# Altium project Audio_Research.PrjPcb (part 5 of 6)

## Sheet Audio_Input_Digitial_Mic.SchDoc: Audio Research: MEMS Microphones
size A4; DrawnBy: Connor Dack; Engineer: Connor Dack; DocumentNumber: 16; Revision: 1.0; SheetNumber: 16; SheetTotal: 20
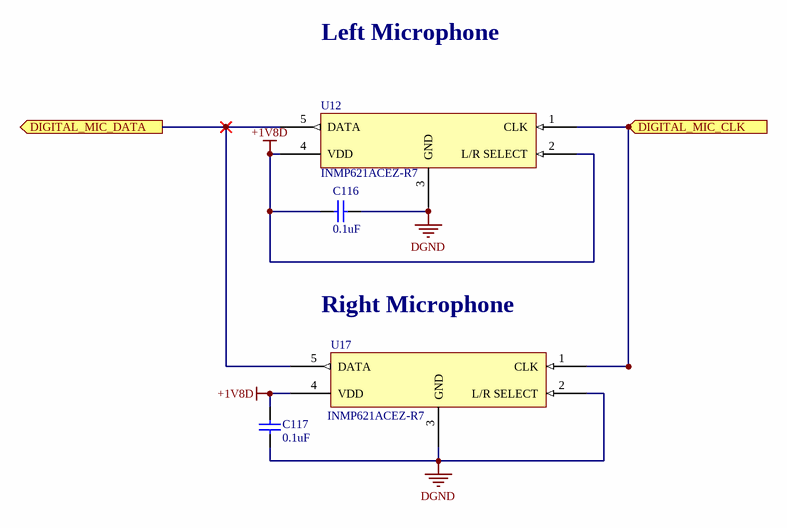
[diagram p14: Audio_Input_Digitial_Mic.SchDoc]

### Parts
C116  Capacitance: 0.1uF  [3-0603_L]  (hidden comment: CL10F104ZO8NNNC)
C117  Capacitance: 0.1uF  [3-0603_L]  (hidden comment: CL10F104ZO8NNNC)
U12  Manufacturer Part Number: INMP621ACEZ-R7  [INMP621]  (hidden comment: INMP621)
U17  Manufacturer Part Number: INMP621ACEZ-R7  [INMP621]  (hidden comment: INMP621)

### Ports
DIGITAL_MIC_CLK (in), DIGITAL_MIC_DATA (out)

### Nets
+1V8D: C116.2 C117.1 U12.2(L/R_SELECT) U12.4(VDD) U17.4(VDD)
DGND: C116.1 C117.2 U12.3(GND) U17.2(L/R_SELECT) U17.3(GND)  [project net AGND]
DIGITAL_MIC_CLK: U12.1(CLK) U17.1(CLK) ; port DIGITAL_MIC_CLK
DIGITAL_MIC_DATA: U12.5(DATA) U17.5(DATA) ; port DIGITAL_MIC_DATA

### Notes on the sheet
- Left Microphone
- (near U17) Right Microphone
- Title:
- Sheet:
- of
- Size:
- A4
- Rev:
- Date:
- Engineer:
- Time:
- File:

### Library data of the parts
C116 C117 = CL10F104ZO8NNNC: as C69 on sheet Audio_Input_Mic_In; Supplier 1: Digi-Key; Stock 1: 40000; Pricing 1: 1=0.1, 10=0.038, 100=0.0169, 500=0.01208, 1000=0.00949 (USD); Mount: Surface Mount; Case/Package: 0603; Case Code (Metric): 1608; Case Code (Imperial): 0603; Min Operating Temperature: -30°C; Max Operating Temperature: 85°C; Package Quantity: 1; Packaging: Tape and Reel; Voltage Rating: 16V; Dielectric: Y5V; Length: 1.6mm; Height: 0.8mm; Width: 0.031inch; Thickness: 0.035inch; Depth: 0.8mm; Radiation Hardening: No; ComponentLink1URL: https://datasheet.ciiva.com/25805/cl10f104zo8nnnc-25805810.pdf; ComponentLink1Description: https://datasheet.ciiva.com/25805/cl10f104zo8nnnc-25805810.pdf; ComponentLink2URL: https://datasheet.ciiva.com/16199/cl10f104zo8nnnc-16199254.pdf; ComponentLink2Description: https://datasheet.ciiva.com/16199/cl10f104zo8nnnc-16199254.pdf; Supplier Part Number 1: 1276-1258-6-ND; Manufacturer Part Number: CL10F104ZO8NNNC
U12 U17 = INMP621: 45Hz ~ 20kHz Digital, PDM Microphone MEMS (Silicon) Omnidirectional (-46dB ±2dB @ 94dB SPL) Solder Pads; Manufacturer: InvenSense; S/N Ratio: 65dB; Voltage Range: 1.62 ~ 3.63V; Current - Supply: 1.6mA; Port Location: Bottom; Seal Rating: None; Shape: Rectangular; Supplier 1: Digi-Key; RoHS: RoHS Compliant; Category: Audio Products; Stock 1: 1211; Pricing 1: 1=2.88, 10=2.491, 25=2.2292, 50=1.9668, 100=1.9012, 250=1.83568, 500=1.77012 (USD); Packaging: Cut Tape (CT); Part Status: Active; Type: MEMS (Silicon); Output Type: Digital, PDM; Direction: Omnidirectional; Frequency Range: 45Hz ~ 20kHz; Sensitivity: -46dB ±2dB @ 94dB SPL; Impedance: -; Voltage - Rated: -; Termination: Solder Pads; Size / Dimension: 4.00mm L x 3.00mm W; Height (Max): 1.10mm; ComponentLink1URL: https://www.invensense.com/wp-content/uploads/2015/02/INMP621.pdf; ComponentLink1Description: https://www.invensense.com/wp-content/uploads/2015/02/INMP621.pdf; Supplier Part Number 1: 1428-1018-1-ND

## Sheet FMC_Block_Diagram.SchDoc: FMC Block Diagram
size A4; DrawnBy: Connor Dack; Engineer: Connor Dack; DocumentNumber: 5; Revision: 1.0; SheetNumber: 5; SheetTotal: 20
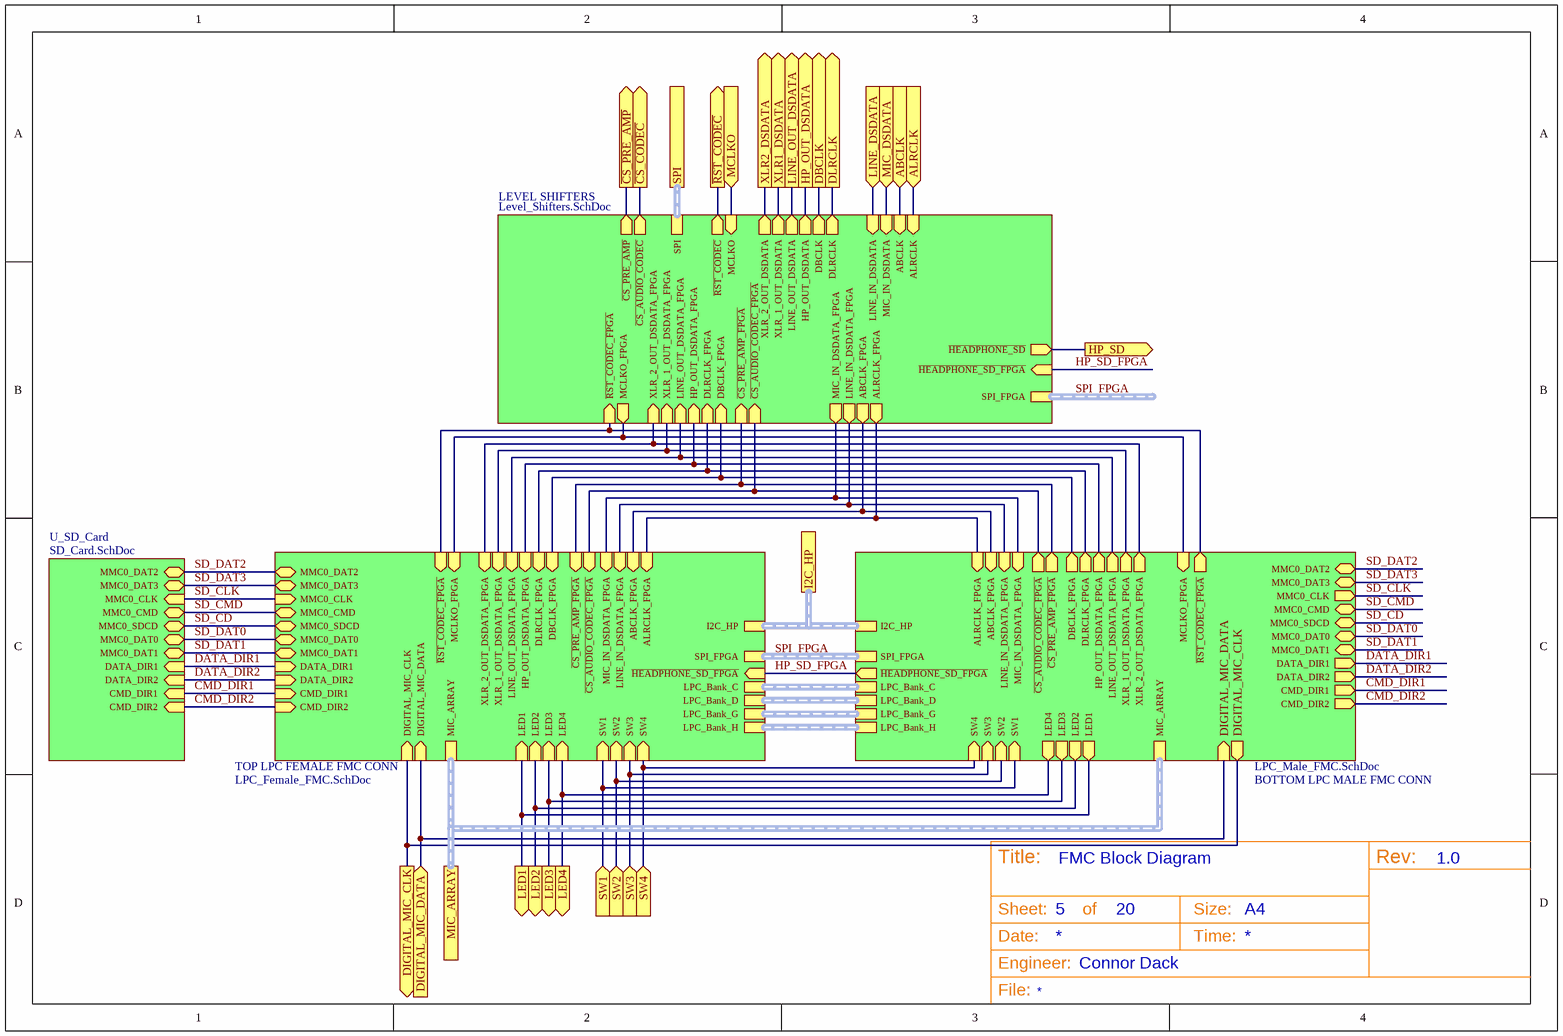
[diagram p15: FMC_Block_Diagram.SchDoc]

### Sub-sheets
BOTTOM LPC MALE FMC CONN = LPC_Male_FMC.SchDoc: SW1 (in), SW3 (in), SW2 (in), SW4 (in), LED1 (out), LED2 (out), LED3 (out), LED4 (out), MIC_ARRAY (harness Microphone Array), ABCLK_FPGA (in), ALRCLK_FPGA (in), DBCLK_FPGA (out), DLRCLK_FPGA (out), HP_OUT_DSDATA_FPGA (out), ~{HEADPHONE_SD_FPGA} (out), LINE_IN_DSDATA_FPGA (in), LINE_OUT_DSDATA_FPGA (out), MCLKO_FPGA (in), MIC_IN_DSDATA_FPGA (in), XLR_1_OUT_DSDATA_FPGA (out), XLR_2_OUT_DSDATA_FPGA (out), ~{RST_CODEC_FPGA} (out), SPI_FPGA (harness SPI_FPGA), ~{CS_AUDIO_CODEC_FPGA} (out), ~{CS_PRE_AMP_FPGA} (out), DIGITAL_MIC_CLK (out), DIGITAL_MIC_DATA (in), I2C_HP (harness I2C), MMC0_DAT2 (bidir), MMC0_DAT3 (bidir), MMC0_CLK (out), MMC0_CMD (bidir), MMC0_SDCD (bidir), MMC0_DAT0 (bidir), MMC0_DAT1 (bidir), LPC_Bank_H (harness LPC_Bank_H), LPC_Bank_G (harness LPC_Bank_G), LPC_Bank_D (harness LPC_Bank_D), LPC_Bank_C (harness LPC_Bank_C), DATA_DIR1 (out), CMD_DIR1 (out), DATA_DIR2 (out), CMD_DIR2 (out)
LEVEL SHIFTERS = Level_Shifters.SchDoc: XLR_2_OUT_DSDATA_FPGA (in), XLR_1_OUT_DSDATA_FPGA (in), LINE_OUT_DSDATA_FPGA (in), MIC_IN_DSDATA_FPGA (out), HP_OUT_DSDATA_FPGA (in), MCLKO_FPGA (out), ~{RST_CODEC_FPGA} (in), ~{HEADPHONE_SD_FPGA} (in), DLRCLK_FPGA (in), DBCLK_FPGA (in), ALRCLK_FPGA (out), ABCLK_FPGA (out), LINE_IN_DSDATA_FPGA (out), XLR_2_OUT_DSDATA (out), HP_OUT_DSDATA (out), MCLKO (in), XLR_1_OUT_DSDATA (out), LINE_OUT_DSDATA (out), MIC_IN_DSDATA (in), ~{RST_CODEC} (out), ~{HEADPHONE_SD} (out), DLRCLK (out), DBCLK (out), ALRCLK (in), ABCLK (in), LINE_IN_DSDATA (in), SPI (harness SPI), SPI_FPGA (harness SPI_FPGA), ~{CS_AUDIO_CODEC} (out), ~{CS_AUDIO_CODEC_FPGA} (in), ~{CS_PRE_AMP} (out), ~{CS_PRE_AMP_FPGA} (in)
TOP LPC FEMALE FMC CONN = LPC_Female_FMC.SchDoc: SW1 (in), SW3 (in), SW2 (in), SW4 (in), LED1 (in), LED2 (in), MIC_ARRAY (harness Microphone Array), LED3 (in), LED4 (in), DBCLK_FPGA (in), DLRCLK_FPGA (in), MIC_IN_DSDATA_FPGA (in), DIGITAL_MIC_DATA (in), ~{HEADPHONE_SD_FPGA} (in), DIGITAL_MIC_CLK (in), MCLKO_FPGA (in), ~{RST_CODEC_FPGA} (in), ALRCLK_FPGA (in), ABCLK_FPGA (in), LINE_IN_DSDATA_FPGA (in), SPI_FPGA (harness SPI_FPGA), HP_OUT_DSDATA_FPGA (in), LINE_OUT_DSDATA_FPGA (in), XLR_1_OUT_DSDATA_FPGA (in), XLR_2_OUT_DSDATA_FPGA (in), ~{CS_AUDIO_CODEC_FPGA} (in), ~{CS_PRE_AMP_FPGA} (in), I2C_HP (harness I2C), MMC0_DAT2 (bidir), MMC0_DAT3 (bidir), MMC0_CLK (in), MMC0_CMD (bidir), MMC0_SDCD (bidir), MMC0_DAT0 (bidir), MMC0_DAT1 (bidir), LPC_Bank_H (harness LPC_Bank_H), LPC_Bank_G (harness LPC_Bank_G), LPC_Bank_D (harness LPC_Bank_D), LPC_Bank_C (harness LPC_Bank_C), DATA_DIR1 (in), CMD_DIR1 (in), DATA_DIR2 (in), CMD_DIR2 (in)
U_SD_Card = SD_Card.SchDoc: MMC0_DAT2 (bidir), MMC0_DAT3 (bidir), MMC0_CLK (in), MMC0_CMD (bidir), MMC0_SDCD (bidir), MMC0_DAT0 (bidir), MMC0_DAT1 (bidir), DATA_DIR1 (in), CMD_DIR1 (in), DATA_DIR2 (in), CMD_DIR2 (in)

### Ports
ABCLK (in), ALRCLK (in), DBCLK (out), DIGITAL_MIC_CLK (out), DIGITAL_MIC_DATA (in), DLRCLK (out), HP_OUT_DSDATA (out), HP_SD (out), I2C_HP, LED1 (out), LED2 (out), LED3 (out), LED4 (out), LINE_DSDATA (in), LINE_OUT_DSDATA (out), MCLKO (in), MIC_ARRAY, MIC_DSDATA (in), SPI, SW1 (in), SW2 (in), SW3 (in), SW4 (in), XLR1_DSDATA (out), XLR2_DSDATA (out), ~{CS_CODEC} (out), ~{CS_PRE_AMP} (out), ~{RST_CODEC} (out)

### Nets
ABCLK: port ABCLK, sheet LEVEL SHIFTERS/ABCLK
ALRCLK: port ALRCLK, sheet LEVEL SHIFTERS/ALRCLK
~{CS_CODEC}: port ~{CS_CODEC}, sheet LEVEL SHIFTERS/~{CS_AUDIO_CODEC}
~{CS_PRE_AMP}: port ~{CS_PRE_AMP}, sheet LEVEL SHIFTERS/~{CS_PRE_AMP}
CMD_DIR1: sheet TOP LPC FEMALE FMC CONN/CMD_DIR1, sheet BOTTOM LPC MALE FMC CONN/CMD_DIR1, sheet U_SD_Card/CMD_DIR1
CMD_DIR2: sheet TOP LPC FEMALE FMC CONN/CMD_DIR2, sheet BOTTOM LPC MALE FMC CONN/CMD_DIR2, sheet U_SD_Card/CMD_DIR2
DATA_DIR1: sheet TOP LPC FEMALE FMC CONN/DATA_DIR1, sheet BOTTOM LPC MALE FMC CONN/DATA_DIR1, sheet U_SD_Card/DATA_DIR1
DATA_DIR2: sheet TOP LPC FEMALE FMC CONN/DATA_DIR2, sheet BOTTOM LPC MALE FMC CONN/DATA_DIR2, sheet U_SD_Card/DATA_DIR2
DBCLK: port DBCLK, sheet LEVEL SHIFTERS/DBCLK
DIGITAL_MIC_CLK: port DIGITAL_MIC_CLK, sheet TOP LPC FEMALE FMC CONN/DIGITAL_MIC_CLK, sheet BOTTOM LPC MALE FMC CONN/DIGITAL_MIC_CLK
DIGITAL_MIC_DATA: port DIGITAL_MIC_DATA, sheet TOP LPC FEMALE FMC CONN/DIGITAL_MIC_DATA, sheet BOTTOM LPC MALE FMC CONN/DIGITAL_MIC_DATA
DLRCLK: port DLRCLK, sheet LEVEL SHIFTERS/DLRCLK
HP_OUT_DSDATA: port HP_OUT_DSDATA, sheet LEVEL SHIFTERS/HP_OUT_DSDATA
HP_SD: port HP_SD, sheet LEVEL SHIFTERS/~{HEADPHONE_SD}
HP_SD_FPGA: sheet TOP LPC FEMALE FMC CONN/~{HEADPHONE_SD_FPGA}, sheet BOTTOM LPC MALE FMC CONN/~{HEADPHONE_SD_FPGA}, sheet LEVEL SHIFTERS/~{HEADPHONE_SD_FPGA}
LED1: port LED1, sheet TOP LPC FEMALE FMC CONN/LED1, sheet BOTTOM LPC MALE FMC CONN/LED1
LED2: port LED2, sheet TOP LPC FEMALE FMC CONN/LED2, sheet BOTTOM LPC MALE FMC CONN/LED2
LED3: port LED3, sheet TOP LPC FEMALE FMC CONN/LED3, sheet BOTTOM LPC MALE FMC CONN/LED3
LED4: port LED4, sheet TOP LPC FEMALE FMC CONN/LED4, sheet BOTTOM LPC MALE FMC CONN/LED4
LINE_DSDATA: port LINE_DSDATA, sheet LEVEL SHIFTERS/LINE_IN_DSDATA
LINE_OUT_DSDATA: port LINE_OUT_DSDATA, sheet LEVEL SHIFTERS/LINE_OUT_DSDATA
MCLKO: port MCLKO, sheet LEVEL SHIFTERS/MCLKO
MIC_DSDATA: port MIC_DSDATA, sheet LEVEL SHIFTERS/MIC_IN_DSDATA
~{RST_CODEC}: port ~{RST_CODEC}, sheet LEVEL SHIFTERS/~{RST_CODEC}
SD_CD: sheet TOP LPC FEMALE FMC CONN/MMC0_SDCD, sheet BOTTOM LPC MALE FMC CONN/MMC0_SDCD, sheet U_SD_Card/MMC0_SDCD
SD_CLK: sheet TOP LPC FEMALE FMC CONN/MMC0_CLK, sheet BOTTOM LPC MALE FMC CONN/MMC0_CLK, sheet U_SD_Card/MMC0_CLK
SD_CMD: sheet TOP LPC FEMALE FMC CONN/MMC0_CMD, sheet BOTTOM LPC MALE FMC CONN/MMC0_CMD, sheet U_SD_Card/MMC0_CMD
SD_DAT0: sheet TOP LPC FEMALE FMC CONN/MMC0_DAT0, sheet BOTTOM LPC MALE FMC CONN/MMC0_DAT0, sheet U_SD_Card/MMC0_DAT0
SD_DAT1: sheet TOP LPC FEMALE FMC CONN/MMC0_DAT1, sheet BOTTOM LPC MALE FMC CONN/MMC0_DAT1, sheet U_SD_Card/MMC0_DAT1
SD_DAT2: sheet TOP LPC FEMALE FMC CONN/MMC0_DAT2, sheet BOTTOM LPC MALE FMC CONN/MMC0_DAT2, sheet U_SD_Card/MMC0_DAT2
SD_DAT3: sheet TOP LPC FEMALE FMC CONN/MMC0_DAT3, sheet BOTTOM LPC MALE FMC CONN/MMC0_DAT3, sheet U_SD_Card/MMC0_DAT3
SW1: port SW1, sheet TOP LPC FEMALE FMC CONN/SW1, sheet BOTTOM LPC MALE FMC CONN/SW1
SW2: port SW2, sheet TOP LPC FEMALE FMC CONN/SW2, sheet BOTTOM LPC MALE FMC CONN/SW2
SW3: port SW3, sheet TOP LPC FEMALE FMC CONN/SW3, sheet BOTTOM LPC MALE FMC CONN/SW3
SW4: port SW4, sheet TOP LPC FEMALE FMC CONN/SW4, sheet BOTTOM LPC MALE FMC CONN/SW4
XLR1_DSDATA: port XLR1_DSDATA, sheet LEVEL SHIFTERS/XLR_1_OUT_DSDATA
XLR2_DSDATA: port XLR2_DSDATA, sheet LEVEL SHIFTERS/XLR_2_OUT_DSDATA
(unnamed): sheet TOP LPC FEMALE FMC CONN/DBCLK_FPGA, sheet BOTTOM LPC MALE FMC CONN/DBCLK_FPGA, sheet LEVEL SHIFTERS/DBCLK_FPGA
(unnamed): sheet TOP LPC FEMALE FMC CONN/DLRCLK_FPGA, sheet BOTTOM LPC MALE FMC CONN/DLRCLK_FPGA, sheet LEVEL SHIFTERS/DLRCLK_FPGA
(unnamed): sheet TOP LPC FEMALE FMC CONN/MIC_IN_DSDATA_FPGA, sheet BOTTOM LPC MALE FMC CONN/MIC_IN_DSDATA_FPGA, sheet LEVEL SHIFTERS/MIC_IN_DSDATA_FPGA
(unnamed): sheet TOP LPC FEMALE FMC CONN/MCLKO_FPGA, sheet BOTTOM LPC MALE FMC CONN/MCLKO_FPGA, sheet LEVEL SHIFTERS/MCLKO_FPGA
(unnamed): sheet TOP LPC FEMALE FMC CONN/~{RST_CODEC_FPGA}, sheet BOTTOM LPC MALE FMC CONN/~{RST_CODEC_FPGA}, sheet LEVEL SHIFTERS/~{RST_CODEC_FPGA}
(unnamed): sheet TOP LPC FEMALE FMC CONN/ALRCLK_FPGA, sheet BOTTOM LPC MALE FMC CONN/ALRCLK_FPGA, sheet LEVEL SHIFTERS/ALRCLK_FPGA
(unnamed): sheet TOP LPC FEMALE FMC CONN/ABCLK_FPGA, sheet BOTTOM LPC MALE FMC CONN/ABCLK_FPGA, sheet LEVEL SHIFTERS/ABCLK_FPGA
(unnamed): sheet TOP LPC FEMALE FMC CONN/LINE_IN_DSDATA_FPGA, sheet BOTTOM LPC MALE FMC CONN/LINE_IN_DSDATA_FPGA, sheet LEVEL SHIFTERS/LINE_IN_DSDATA_FPGA
(unnamed): sheet TOP LPC FEMALE FMC CONN/HP_OUT_DSDATA_FPGA, sheet BOTTOM LPC MALE FMC CONN/HP_OUT_DSDATA_FPGA, sheet LEVEL SHIFTERS/HP_OUT_DSDATA_FPGA
(unnamed): sheet TOP LPC FEMALE FMC CONN/LINE_OUT_DSDATA_FPGA, sheet BOTTOM LPC MALE FMC CONN/LINE_OUT_DSDATA_FPGA, sheet LEVEL SHIFTERS/LINE_OUT_DSDATA_FPGA
(unnamed): sheet TOP LPC FEMALE FMC CONN/XLR_1_OUT_DSDATA_FPGA, sheet BOTTOM LPC MALE FMC CONN/XLR_1_OUT_DSDATA_FPGA, sheet LEVEL SHIFTERS/XLR_1_OUT_DSDATA_FPGA
(unnamed): sheet TOP LPC FEMALE FMC CONN/XLR_2_OUT_DSDATA_FPGA, sheet BOTTOM LPC MALE FMC CONN/XLR_2_OUT_DSDATA_FPGA, sheet LEVEL SHIFTERS/XLR_2_OUT_DSDATA_FPGA
(unnamed): sheet TOP LPC FEMALE FMC CONN/~{CS_AUDIO_CODEC_FPGA}, sheet BOTTOM LPC MALE FMC CONN/~{CS_AUDIO_CODEC_FPGA}, sheet LEVEL SHIFTERS/~{CS_AUDIO_CODEC_FPGA}
(unnamed): sheet TOP LPC FEMALE FMC CONN/~{CS_PRE_AMP_FPGA}, sheet BOTTOM LPC MALE FMC CONN/~{CS_PRE_AMP_FPGA}, sheet LEVEL SHIFTERS/~{CS_PRE_AMP_FPGA}

### Buses and harness runs
harness port I2C_HP = sheet BOTTOM LPC MALE FMC CONN/I2C_HP = sheet TOP LPC FEMALE FMC CONN/I2C_HP
harness port MIC_ARRAY = sheet BOTTOM LPC MALE FMC CONN/MIC_ARRAY = sheet TOP LPC FEMALE FMC CONN/MIC_ARRAY
harness port SPI = sheet LEVEL SHIFTERS/SPI
harness sheet BOTTOM LPC MALE FMC CONN/LPC_Bank_C = sheet TOP LPC FEMALE FMC CONN/LPC_Bank_C
harness sheet BOTTOM LPC MALE FMC CONN/LPC_Bank_D = sheet TOP LPC FEMALE FMC CONN/LPC_Bank_D
harness sheet BOTTOM LPC MALE FMC CONN/LPC_Bank_G = sheet TOP LPC FEMALE FMC CONN/LPC_Bank_G
harness sheet BOTTOM LPC MALE FMC CONN/LPC_Bank_H = sheet TOP LPC FEMALE FMC CONN/LPC_Bank_H
harness SPI_FPGA = sheet BOTTOM LPC MALE FMC CONN/SPI_FPGA = sheet TOP LPC FEMALE FMC CONN/SPI_FPGA
harness SPI_FPGA = sheet LEVEL SHIFTERS/SPI_FPGA

### Notes on the sheet
- Title:
- Sheet:
- of
- Size:
- A4
- Rev:
- Date:
- Engineer:
- Time:
- File:

## Sheet LPC_Female_FMC.SchDoc: Audio Research: LPC Female FMC Conn
size A4; DrawnBy: Connor Dack; Engineer: Connor Dack; DocumentNumber: 7; Revision: 1.0; SheetNumber: 7; SheetTotal: 20
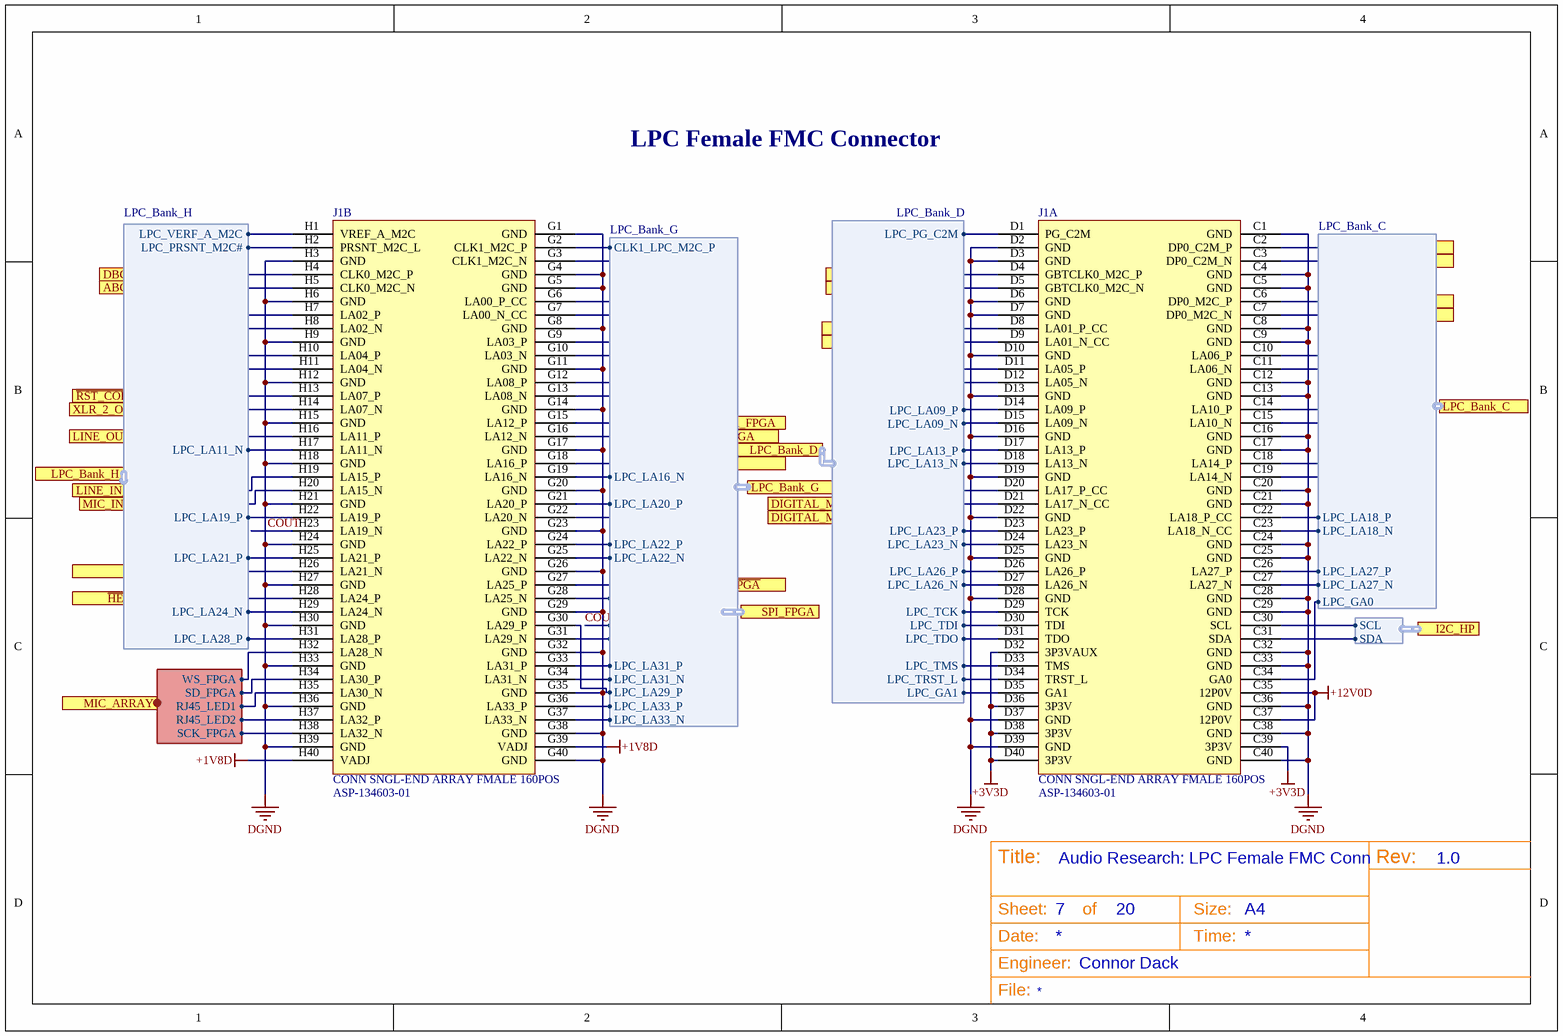
[diagram p16: LPC_Female_FMC.SchDoc]

### Parts
J1  CONN SNGL-END ARRAY FMALE 160POS  [ASP-134603-01]  (parts A,B of 2)

### Ports
ABCLK_FPGA (in), ALRCLK_FPGA (in), CMD_DIR1 (in), CMD_DIR2 (in), DATA_DIR1 (in), DATA_DIR2 (in), DBCLK_FPGA (in), DIGITAL_MIC_CLK (in), DIGITAL_MIC_DATA (in), DLRCLK_FPGA (in), HP_OUT_DSDATA_FPGA (in), I2C_HP (harness I2C), LED1 (in), LED2 (in), LED3 (in), LED4 (in), LINE_IN_DSDATA_FPGA (in), LINE_OUT_DSDATA_FPGA (in), LPC_Bank_C (harness LPC_Bank_C), LPC_Bank_D (harness LPC_Bank_D), LPC_Bank_G (harness LPC_Bank_G), LPC_Bank_H (harness LPC_Bank_H), MCLKO_FPGA (in), MIC_ARRAY (harness Microphone Array), MIC_IN_DSDATA_FPGA (in), MMC0_CLK (in), MMC0_CMD (bidir), MMC0_DAT0 (bidir), MMC0_DAT1 (bidir), MMC0_DAT2 (bidir), MMC0_DAT3 (bidir), MMC0_SDCD (bidir), SPI_FPGA (harness SPI_FPGA), SW1 (in), SW2 (in), SW3 (in), SW4 (in), XLR_1_OUT_DSDATA_FPGA (in), XLR_2_OUT_DSDATA_FPGA (in), ~{CS_AUDIO_CODEC_FPGA} (in), ~{CS_PRE_AMP_FPGA} (in), ~{HEADPHONE_SD_FPGA} (in), ~{RST_CODEC_FPGA} (in)

### Harnesses
LPC_Bank_C: LPC_GA0, LPC_LA18_P, LPC_LA18_N, LPC_LA27_P, LPC_LA27_N
LPC_Bank_D: LPC_PG_C2M, LPC_TCK, LPC_TDI, LPC_TDO, LPC_TMS, LPC_TRST_L, LPC_GA1, LPC_LA13_N, LPC_LA23_P, LPC_LA23_N, LPC_LA26_P, LPC_LA26_N, LPC_LA13_P, LPC_LA09_N, LPC_LA09_P
LPC_Bank_H: LPC_VERF_A_M2C, LPC_PRSNT_M2C#, LPC_LA21_P, LPC_LA24_N, LPC_LA28_P, LPC_LA19_P, LPC_LA11_N
SPI_FPGA: CIN_FPGA, COUT_FPGA, CCLK_FPGA
Microphone Array: SD_FPGA, SCK_FPGA, WS_FPGA, RJ45_LED1, RJ45_LED2
I2C: SDA, SCL
LPC_Bank_G: CLK1_LPC_M2C_P, LPC_LA20_P, LPC_LA22_P, LPC_LA22_N, LPC_LA31_P, LPC_LA31_N, LPC_LA33_P, LPC_LA33_N, LPC_LA29_P, LPC_LA16_N

### Nets
+1V8D: J1.G39(VADJ) J1.H40(VADJ)
+3V3D: J1.C39(3P3V) J1.D32(3P3VAUX) J1.D36(3P3V) J1.D38(3P3V) J1.D40(3P3V)
+12V0D: J1.C10(LA06_P) J1.C11(LA06_N) J1.C35(12P0V) J1.C37(12P0V) J1.D11(LA05_P) J1.D12(LA05_N) J1.G12(LA08_P) J1.G13(LA08_N) J1.H11(LA04_N)
DGND: J1.C1(GND) J1.C4(GND) J1.C5(GND) J1.C8(GND) J1.C9(GND) J1.C12(GND) J1.C13(GND) J1.C16(GND) J1.C17(GND) J1.C20(GND) J1.C21(GND) J1.C24(GND) J1.C25(GND) J1.C28(GND) J1.C29(GND) J1.C32(GND) J1.C33(GND) J1.C36(GND) J1.C38(GND) J1.C40(GND) J1.D2(GND) J1.D3(GND) J1.D6(GND) J1.D7(GND) J1.D10(GND) J1.D13(GND) J1.D16(GND) J1.D19(GND) J1.D22(GND) J1.D25(GND) J1.D28(GND) J1.D37(GND) J1.D39(GND) J1.G1(GND) J1.G4(GND) J1.G5(GND) J1.G8(GND) J1.G11(GND) J1.G14(GND) J1.G17(GND) J1.G20(GND) J1.G23(GND) J1.G26(GND) J1.G29(GND) J1.G32(GND) J1.G35(GND) J1.G38(GND) J1.G40(GND) J1.H3(GND) J1.H6(GND) J1.H9(GND) J1.H12(GND) J1.H15(GND) J1.H18(GND) J1.H21(GND) J1.H24(GND) J1.H27(GND) J1.H30(GND) J1.H33(GND) J1.H36(GND) J1.H39(GND)  [project net AGND]
~{RST_CODEC_FPGA}: J1.H13(LA07_P) ; port ~{RST_CODEC_FPGA}
ABCLK_FPGA: J1.H5(CLK0_M2C_N) ; port ABCLK_FPGA
ALRCLK_FPGA: J1.G22(LA20_N) ; port ALRCLK_FPGA
~{CS_AUDIO_CODEC_FPGA}: J1.G27(LA25_P) ; port ~{CS_AUDIO_CODEC_FPGA}
~{CS_PRE_AMP_FPGA}: J1.H26(LA21_N) ; port ~{CS_PRE_AMP_FPGA}
CMD_DIR1: J1.C19(LA14_N) ; port CMD_DIR1
CMD_DIR2: J1.C18(LA14_P) ; port CMD_DIR2
COUT: J1.H23(LA19_N) ; port SPI_FPGA.COUT_FPGA
DATA_DIR1: J1.C15(LA10_N) ; port DATA_DIR1
DATA_DIR2: J1.C14(LA10_P) ; port DATA_DIR2
DBCLK_FPGA: J1.H4(CLK0_M2C_P) ; port DBCLK_FPGA
DIGITAL_MIC_CLK: J1.D20(LA17_P_CC) ; port DIGITAL_MIC_CLK
DIGITAL_MIC_DATA: J1.D21(LA17_N_CC) ; port DIGITAL_MIC_DATA
DLRCLK_FPGA: J1.G18(LA16_P) ; port DLRCLK_FPGA
~{HEADPHONE_SD_FPGA}: J1.H28(LA24_P) ; port ~{HEADPHONE_SD_FPGA}
HP_OUT_DSDATA_FPGA: J1.G16(LA12_N) ; port HP_OUT_DSDATA_FPGA
LED1: J1.C7(DP0_M2C_N) ; port LED1
LED2: J1.D8(LA01_P_CC) ; port LED2
LED3: J1.D9(LA01_N_CC) ; port LED3
LED4: J1.C6(DP0_M2C_P) ; port LED4
LINE_IN_DSDATA_FPGA: J1.H19(LA15_P) ; port LINE_IN_DSDATA_FPGA
LINE_OUT_DSDATA_FPGA: J1.H16(LA11_P) ; port LINE_OUT_DSDATA_FPGA
MCLKO_FPGA: J1.G3(CLK1_M2C_N) ; port MCLKO_FPGA
MIC_IN_DSDATA_FPGA: J1.H20(LA15_N) ; port MIC_IN_DSDATA_FPGA
MMC0_CLK: J1.G7(LA00_N_CC) ; port MMC0_CLK
MMC0_CMD: J1.G9(LA03_P) ; port MMC0_CMD
MMC0_DAT0: J1.G10(LA03_N) ; port MMC0_DAT0
MMC0_DAT1: J1.H10(LA04_P) ; port MMC0_DAT1
MMC0_DAT2: J1.H7(LA02_P) ; port MMC0_DAT2
MMC0_DAT3: J1.H8(LA02_N) ; port MMC0_DAT3
MMC0_SDCD: J1.G6(LA00_P_CC) ; port MMC0_SDCD
RJ45_LED1: J1.H35(LA30_N) ; port MIC_ARRAY.RJ45_LED1
RJ45_LED2: J1.H37(LA32_P) ; port MIC_ARRAY.RJ45_LED2
SW1: J1.C2(DP0_C2M_P) ; port SW1
SW2: J1.C3(DP0_C2M_N) ; port SW2
SW3: J1.D4(GBTCLK0_M2C_P) ; port SW3
SW4: J1.D5(GBTCLK0_M2C_N) ; port SW4
XLR_1_OUT_DSDATA_FPGA: J1.G15(LA12_P) ; port XLR_1_OUT_DSDATA_FPGA
XLR_2_OUT_DSDATA_FPGA: J1.H14(LA07_N) ; port XLR_2_OUT_DSDATA_FPGA
NetJ1_C22: J1.C22(LA18_P_CC) ; port LPC_Bank_C.LPC_LA18_P
NetJ1_C23: J1.C23(LA18_N_CC) ; port LPC_Bank_C.LPC_LA18_N
NetJ1_C26: J1.C26(LA27_P) ; port LPC_Bank_C.LPC_LA27_P
NetJ1_C27: J1.C27(LA27_N) ; port LPC_Bank_C.LPC_LA27_N
NetJ1_C30: J1.C30(SCL) ; port I2C_HP.SCL
NetJ1_C31: J1.C31(SDA) ; port I2C_HP.SDA
NetJ1_C34: J1.C34(GA0) ; port LPC_Bank_C.LPC_GA0
NetJ1_D1: J1.D1(PG_C2M) ; port LPC_Bank_D.LPC_PG_C2M
NetJ1_D14: J1.D14(LA09_P) ; port LPC_Bank_D.LPC_LA09_P
NetJ1_D15: J1.D15(LA09_N) ; port LPC_Bank_D.LPC_LA09_N
NetJ1_D17: J1.D17(LA13_P) ; port LPC_Bank_D.LPC_LA13_P
NetJ1_D18: J1.D18(LA13_N) ; port LPC_Bank_D.LPC_LA13_N
NetJ1_D23: J1.D23(LA23_P) ; port LPC_Bank_D.LPC_LA23_P
NetJ1_D24: J1.D24(LA23_N) ; port LPC_Bank_D.LPC_LA23_N
NetJ1_D26: J1.D26(LA26_P) ; port LPC_Bank_D.LPC_LA26_P
NetJ1_D27: J1.D27(LA26_N) ; port LPC_Bank_D.LPC_LA26_N
NetJ1_D29: J1.D29(TCK) ; port LPC_Bank_D.LPC_TCK
NetJ1_D30: J1.D30(TDI) ; port LPC_Bank_D.LPC_TDI
NetJ1_D31: J1.D31(TDO) ; port LPC_Bank_D.LPC_TDO
NetJ1_D33: J1.D33(TMS) ; port LPC_Bank_D.LPC_TMS
NetJ1_D34: J1.D34(TRST_L) ; port LPC_Bank_D.LPC_TRST_L
NetJ1_D35: J1.D35(GA1) ; port LPC_Bank_D.LPC_GA1
NetJ1_G2: J1.G2(CLK1_M2C_P) ; port LPC_Bank_G.CLK1_LPC_M2C_P
NetJ1_G19: J1.G19(LA16_N) ; port LPC_Bank_G.LPC_LA16_N
NetJ1_G21: J1.G21(LA20_P) ; port LPC_Bank_G.LPC_LA20_P
NetJ1_G24: J1.G24(LA22_P) ; port LPC_Bank_G.LPC_LA22_P
NetJ1_G25: J1.G25(LA22_N) ; port LPC_Bank_G.LPC_LA22_N
NetJ1_G28: J1.G28(LA25_N) ; port SPI_FPGA.CIN_FPGA
NetJ1_G30: J1.G30(LA29_P) ; port LPC_Bank_G.LPC_LA29_P
NetJ1_G31: J1.G31(LA29_N) ; port SPI_FPGA.CCLK_FPGA
NetJ1_G33: J1.G33(LA31_P) ; port LPC_Bank_G.LPC_LA31_P
NetJ1_G34: J1.G34(LA31_N) ; port LPC_Bank_G.LPC_LA31_N
NetJ1_G36: J1.G36(LA33_P) ; port LPC_Bank_G.LPC_LA33_P
NetJ1_G37: J1.G37(LA33_N) ; port LPC_Bank_G.LPC_LA33_N
NetJ1_H1: J1.H1(VREF_A_M2C) ; port LPC_Bank_H.LPC_VERF_A_M2C
NetJ1_H2: J1.H2(PRSNT_M2C_L) ; port LPC_Bank_H.LPC_PRSNT_M2C#
NetJ1_H17: J1.H17(LA11_N) ; port LPC_Bank_H.LPC_LA11_N
NetJ1_H22: J1.H22(LA19_P) ; port LPC_Bank_H.LPC_LA19_P
NetJ1_H25: J1.H25(LA21_P) ; port LPC_Bank_H.LPC_LA21_P
NetJ1_H29: J1.H29(LA24_N) ; port LPC_Bank_H.LPC_LA24_N
NetJ1_H31: J1.H31(LA28_P) ; port LPC_Bank_H.LPC_LA28_P
NetJ1_H32: J1.H32(LA28_N) ; port MIC_ARRAY.WS_FPGA
NetJ1_H34: J1.H34(LA30_P) ; port MIC_ARRAY.SD_FPGA
NetJ1_H38: J1.H38(LA32_N) ; port MIC_ARRAY.SCK_FPGA

### Notes on the sheet
- LPC Female FMC Connector
- Title:
- Sheet:
- of
- Size:
- A4
- Rev:
- Date:
- Engineer:
- Time:
- File:

### Library data of the parts
J1 = ASP-134603-01: Low Pin Count Female FPGA Mezzanine Card Connector; Manufacturer: Samtec; Number of Positions: 160; Gender: Receptacle; Pitch: 1.27mm; Load Status: DNI; Supplier 1: Digi-Key; Stock 1: 418; Pricing 1: 1=12.68, 10=12.253, 25=11.83, 50=11.4076, 100=10.985, 250=10.7738, 500=10.5625 (USD); Mount: Surface Mount; Contact Plating: Nickel,Gold; Contact Material: Copper Alloy; Housing Colour: Black; Number of Rows: 4; Packaging: Tape and Reel; Termination: Solder; Number of Contacts: 160; Orientation: Straight; Depth: 13.23mm; Radiation Hardening: No; REACH SVHC: No SVHC; ComponentLink1URL: https://datasheet.ciiva.com/403/asp-134603-01-403748.pdf; ComponentLink1Description: https://datasheet.ciiva.com/403/asp-134603-01-403748.pdf; ComponentLink2URL: https://datasheet.ciiva.com/26877/getdatasheetpartid-748375-26877304.pdf; ComponentLink2Description: https://datasheet.ciiva.com/26877/getdatasheetpartid-748375-26877304.pdf; Supplier Part Number 1: SAM8729-ND; Manufacturer Part Number: ASP-134603-01

## Sheet LPC_Male_FMC.SchDoc: Audio Research: LPC Male FMC Conn
size A4; DrawnBy: Connor Dack; Engineer: Connor Dack; DocumentNumber: 8; Revision: 1.0; SheetNumber: 8; SheetTotal: 20
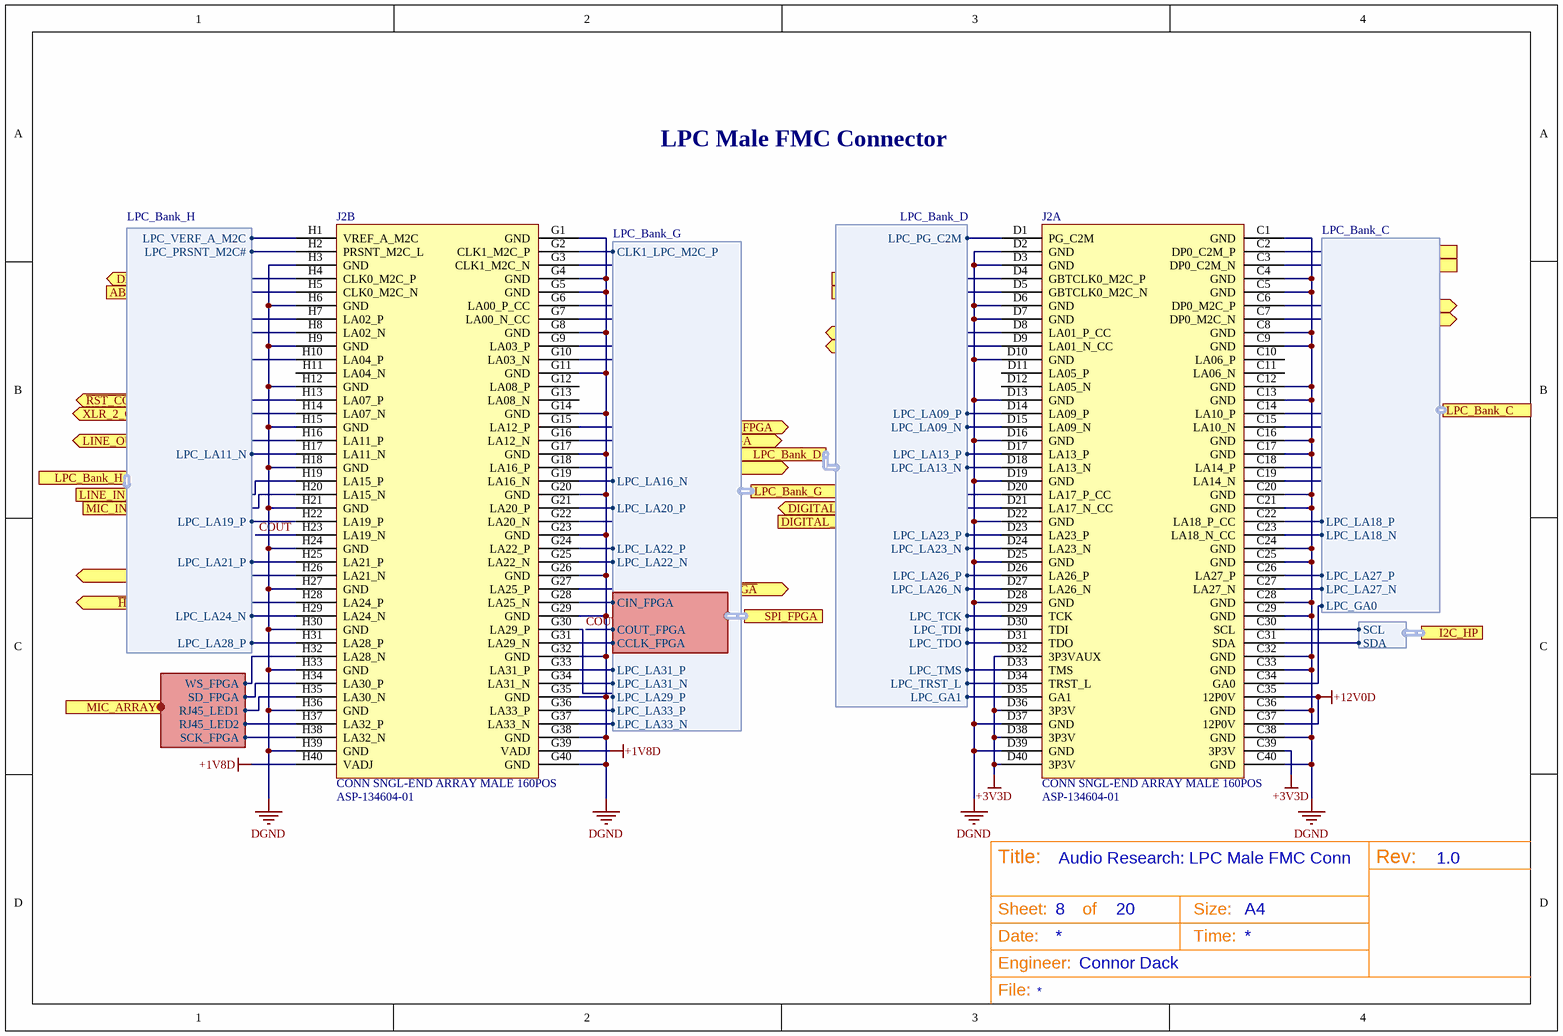
[diagram p17: LPC_Male_FMC.SchDoc]

### Parts
J2  CONN SNGL-END ARRAY MALE 160POS  [ASP-134604-01]  (parts A,B of 2)

### Ports
ABCLK_FPGA (in), ALRCLK_FPGA (in), CMD_DIR1 (out), CMD_DIR2 (out), DATA_DIR1 (out), DATA_DIR2 (out), DBCLK_FPGA (out), DIGITAL_MIC_CLK (out), DIGITAL_MIC_DATA (in), DLRCLK_FPGA (out), HP_OUT_DSDATA_FPGA (out), I2C_HP (harness I2C), LED1 (out), LED2 (out), LED3 (out), LED4 (out), LINE_IN_DSDATA_FPGA (in), LINE_OUT_DSDATA_FPGA (out), LPC_Bank_C (harness LPC_Bank_C), LPC_Bank_D (harness LPC_Bank_D), LPC_Bank_G (harness LPC_Bank_G), LPC_Bank_H (harness LPC_Bank_H), MCLKO_FPGA (in), MIC_ARRAY (harness Microphone Array), MIC_IN_DSDATA_FPGA (in), MMC0_CLK (out), MMC0_CMD (bidir), MMC0_DAT0 (bidir), MMC0_DAT1 (bidir), MMC0_DAT2 (bidir), MMC0_DAT3 (bidir), MMC0_SDCD (bidir), SPI_FPGA (harness SPI_FPGA), SW1 (in), SW2 (in), SW3 (in), SW4 (in), XLR_1_OUT_DSDATA_FPGA (out), XLR_2_OUT_DSDATA_FPGA (out), ~{CS_AUDIO_CODEC_FPGA} (out), ~{CS_PRE_AMP_FPGA} (out), ~{HEADPHONE_SD_FPGA} (out), ~{RST_CODEC_FPGA} (out)

### Harnesses
LPC_Bank_C: LPC_GA0, LPC_LA18_P, LPC_LA18_N, LPC_LA27_P, LPC_LA27_N
LPC_Bank_D: LPC_PG_C2M, LPC_TCK, LPC_TDI, LPC_TDO, LPC_TMS, LPC_TRST_L, LPC_GA1, LPC_LA13_N, LPC_LA23_P, LPC_LA23_N, LPC_LA26_P, LPC_LA26_N, LPC_LA13_P, LPC_LA09_N, LPC_LA09_P
LPC_Bank_G: LPC_LA20_P, LPC_LA22_P, LPC_LA22_N, LPC_LA31_P, LPC_LA31_N, LPC_LA33_P, LPC_LA33_N, LPC_LA29_P, CLK1_LPC_M2C_P, LPC_LA16_N
LPC_Bank_H: LPC_VERF_A_M2C, LPC_PRSNT_M2C#, LPC_LA21_P, LPC_LA24_N, LPC_LA28_P, LPC_LA19_P, LPC_LA11_N
SPI_FPGA: CIN_FPGA, COUT_FPGA, CCLK_FPGA
Microphone Array: SD_FPGA, SCK_FPGA, WS_FPGA, RJ45_LED1, RJ45_LED2
I2C: SDA, SCL

### Nets
+1V8D: J2.G39(VADJ) J2.H40(VADJ)
+3V3D: J2.C39(3P3V) J2.D32(3P3VAUX) J2.D36(3P3V) J2.D38(3P3V) J2.D40(3P3V)
+12V0D: J2.C35(12P0V) J2.C37(12P0V)
DGND: J2.C1(GND) J2.C4(GND) J2.C5(GND) J2.C8(GND) J2.C9(GND) J2.C12(GND) J2.C13(GND) J2.C16(GND) J2.C17(GND) J2.C20(GND) J2.C21(GND) J2.C24(GND) J2.C25(GND) J2.C28(GND) J2.C29(GND) J2.C32(GND) J2.C33(GND) J2.C36(GND) J2.C38(GND) J2.C40(GND) J2.D2(GND) J2.D3(GND) J2.D6(GND) J2.D7(GND) J2.D10(GND) J2.D13(GND) J2.D16(GND) J2.D19(GND) J2.D22(GND) J2.D25(GND) J2.D28(GND) J2.D37(GND) J2.D39(GND) J2.G1(GND) J2.G4(GND) J2.G5(GND) J2.G8(GND) J2.G11(GND) J2.G14(GND) J2.G17(GND) J2.G20(GND) J2.G23(GND) J2.G26(GND) J2.G29(GND) J2.G32(GND) J2.G35(GND) J2.G38(GND) J2.G40(GND) J2.H3(GND) J2.H6(GND) J2.H9(GND) J2.H12(GND) J2.H15(GND) J2.H18(GND) J2.H21(GND) J2.H24(GND) J2.H27(GND) J2.H30(GND) J2.H33(GND) J2.H36(GND) J2.H39(GND)  [project net AGND]
~{RST_CODEC_FPGA}: J2.H13(LA07_P) ; port ~{RST_CODEC_FPGA}
ABCLK_FPGA: J2.H5(CLK0_M2C_N) ; port ABCLK_FPGA
ALRCLK_FPGA: J2.G22(LA20_N) ; port ALRCLK_FPGA
~{CS_AUDIO_CODEC_FPGA}: J2.G27(LA25_P) ; port ~{CS_AUDIO_CODEC_FPGA}
~{CS_PRE_AMP_FPGA}: J2.H26(LA21_N) ; port ~{CS_PRE_AMP_FPGA}
CMD_DIR1: J2.C19(LA14_N) ; port CMD_DIR1
CMD_DIR2: J2.C18(LA14_P) ; port CMD_DIR2
COUT: J2.H23(LA19_N) ; port SPI_FPGA.COUT_FPGA
DATA_DIR1: J2.C15(LA10_N) ; port DATA_DIR1
DATA_DIR2: J2.C14(LA10_P) ; port DATA_DIR2
DBCLK_FPGA: J2.H4(CLK0_M2C_P) ; port DBCLK_FPGA
DIGITAL_MIC_CLK: J2.D20(LA17_P_CC) ; port DIGITAL_MIC_CLK
DIGITAL_MIC_DATA: J2.D21(LA17_N_CC) ; port DIGITAL_MIC_DATA
DLRCLK_FPGA: J2.G18(LA16_P) ; port DLRCLK_FPGA
~{HEADPHONE_SD_FPGA}: J2.H28(LA24_P) ; port ~{HEADPHONE_SD_FPGA}
HP_OUT_DSDATA_FPGA: J2.G16(LA12_N) ; port HP_OUT_DSDATA_FPGA
LED1: J2.C7(DP0_M2C_N) ; port LED1
LED2: J2.D8(LA01_P_CC) ; port LED2
LED3: J2.D9(LA01_N_CC) ; port LED3
LED4: J2.C6(DP0_M2C_P) ; port LED4
LINE_IN_DSDATA_FPGA: J2.H19(LA15_P) ; port LINE_IN_DSDATA_FPGA
LINE_OUT_DSDATA_FPGA: J2.H16(LA11_P) ; port LINE_OUT_DSDATA_FPGA
MCLKO_FPGA: J2.G3(CLK1_M2C_N) ; port MCLKO_FPGA
MIC_IN_DSDATA_FPGA: J2.H20(LA15_N) ; port MIC_IN_DSDATA_FPGA
MMC0_CLK: J2.G7(LA00_N_CC) ; port MMC0_CLK
MMC0_CMD: J2.G9(LA03_P) ; port MMC0_CMD
MMC0_DAT0: J2.G10(LA03_N) ; port MMC0_DAT0
MMC0_DAT1: J2.H10(LA04_P) ; port MMC0_DAT1
MMC0_DAT2: J2.H7(LA02_P) ; port MMC0_DAT2
MMC0_DAT3: J2.H8(LA02_N) ; port MMC0_DAT3
MMC0_SDCD: J2.G6(LA00_P_CC) ; port MMC0_SDCD
RJ45_LED1: J2.H35(LA30_N) ; port MIC_ARRAY.RJ45_LED1
RJ45_LED2: J2.H37(LA32_P) ; port MIC_ARRAY.RJ45_LED2
SW1: J2.C2(DP0_C2M_P) ; port SW1
SW2: J2.C3(DP0_C2M_N) ; port SW2
SW3: J2.D4(GBTCLK0_M2C_P) ; port SW3
SW4: J2.D5(GBTCLK0_M2C_N) ; port SW4
XLR_1_OUT_DSDATA_FPGA: J2.G15(LA12_P) ; port XLR_1_OUT_DSDATA_FPGA
XLR_2_OUT_DSDATA_FPGA: J2.H14(LA07_N) ; port XLR_2_OUT_DSDATA_FPGA
NetJ1_C22: J2.C22(LA18_P_CC) ; port LPC_Bank_C.LPC_LA18_P
NetJ1_C23: J2.C23(LA18_N_CC) ; port LPC_Bank_C.LPC_LA18_N
NetJ1_C26: J2.C26(LA27_P) ; port LPC_Bank_C.LPC_LA27_P
NetJ1_C27: J2.C27(LA27_N) ; port LPC_Bank_C.LPC_LA27_N
NetJ1_C30: J2.C30(SCL) ; port I2C_HP.SCL
NetJ1_C31: J2.C31(SDA) ; port I2C_HP.SDA
NetJ1_C34: J2.C34(GA0) ; port LPC_Bank_C.LPC_GA0
NetJ1_D1: J2.D1(PG_C2M) ; port LPC_Bank_D.LPC_PG_C2M
NetJ1_D14: J2.D14(LA09_P) ; port LPC_Bank_D.LPC_LA09_P
NetJ1_D15: J2.D15(LA09_N) ; port LPC_Bank_D.LPC_LA09_N
NetJ1_D17: J2.D17(LA13_P) ; port LPC_Bank_D.LPC_LA13_P
NetJ1_D18: J2.D18(LA13_N) ; port LPC_Bank_D.LPC_LA13_N
NetJ1_D23: J2.D23(LA23_P) ; port LPC_Bank_D.LPC_LA23_P
NetJ1_D24: J2.D24(LA23_N) ; port LPC_Bank_D.LPC_LA23_N
NetJ1_D26: J2.D26(LA26_P) ; port LPC_Bank_D.LPC_LA26_P
NetJ1_D27: J2.D27(LA26_N) ; port LPC_Bank_D.LPC_LA26_N
NetJ1_D29: J2.D29(TCK) ; port LPC_Bank_D.LPC_TCK
NetJ1_D30: J2.D30(TDI) ; port LPC_Bank_D.LPC_TDI
NetJ1_D31: J2.D31(TDO) ; port LPC_Bank_D.LPC_TDO
NetJ1_D33: J2.D33(TMS) ; port LPC_Bank_D.LPC_TMS
NetJ1_D34: J2.D34(TRST_L) ; port LPC_Bank_D.LPC_TRST_L
NetJ1_D35: J2.D35(GA1) ; port LPC_Bank_D.LPC_GA1
NetJ1_G2: J2.G2(CLK1_M2C_P) ; port LPC_Bank_G.CLK1_LPC_M2C_P
NetJ1_G19: J2.G19(LA16_N) ; port LPC_Bank_G.LPC_LA16_N
NetJ1_G21: J2.G21(LA20_P) ; port LPC_Bank_G.LPC_LA20_P
NetJ1_G24: J2.G24(LA22_P) ; port LPC_Bank_G.LPC_LA22_P
NetJ1_G25: J2.G25(LA22_N) ; port LPC_Bank_G.LPC_LA22_N
NetJ1_G28: J2.G28(LA25_N) ; port SPI_FPGA.CIN_FPGA
NetJ1_G30: J2.G30(LA29_P) ; port LPC_Bank_G.LPC_LA29_P
NetJ1_G31: J2.G31(LA29_N) ; port SPI_FPGA.CCLK_FPGA
NetJ1_G33: J2.G33(LA31_P) ; port LPC_Bank_G.LPC_LA31_P
NetJ1_G34: J2.G34(LA31_N) ; port LPC_Bank_G.LPC_LA31_N
NetJ1_G36: J2.G36(LA33_P) ; port LPC_Bank_G.LPC_LA33_P
NetJ1_G37: J2.G37(LA33_N) ; port LPC_Bank_G.LPC_LA33_N
NetJ1_H1: J2.H1(VREF_A_M2C) ; port LPC_Bank_H.LPC_VERF_A_M2C
NetJ1_H2: J2.H2(PRSNT_M2C_L) ; port LPC_Bank_H.LPC_PRSNT_M2C#
NetJ1_H17: J2.H17(LA11_N) ; port LPC_Bank_H.LPC_LA11_N
NetJ1_H22: J2.H22(LA19_P) ; port LPC_Bank_H.LPC_LA19_P
NetJ1_H25: J2.H25(LA21_P) ; port LPC_Bank_H.LPC_LA21_P
NetJ1_H29: J2.H29(LA24_N) ; port LPC_Bank_H.LPC_LA24_N
NetJ1_H31: J2.H31(LA28_P) ; port LPC_Bank_H.LPC_LA28_P
NetJ1_H32: J2.H32(LA28_N) ; port MIC_ARRAY.WS_FPGA
NetJ1_H34: J2.H34(LA30_P) ; port MIC_ARRAY.SD_FPGA
NetJ1_H38: J2.H38(LA32_N) ; port MIC_ARRAY.SCK_FPGA

Not connected (* = marked no-connect by the designer): J2 C10(LA06_P) C11(LA06_N) D11(LA05_P) D12(LA05_N) G12(LA08_P) G13(LA08_N) H11(LA04_N)

### Notes on the sheet
- LPC Male FMC Connector
- Title:
- Sheet:
- of
- Size:
- A4
- Rev:
- Date:
- Engineer:
- Time:
- File:

### Library data of the parts
J2 = ASP-134604-01: Low Pin Count 10mm Male FPGA Mezzanine Card Connector; Manufacturer: Samtec; Number of Contacts: 400; Number of Positions: 160; Pitch: 0.05inch; Supplier 1: Digi-Key; Stock 1: 825; Pricing 1: 1=13.68, 10=13.224, 25=12.768, 50=12.312, 100=11.856, 250=11.628, 500=11.4 (USD); Mount: Surface Mount; Contact Plating: Nickel,Gold; Contact Material: Copper Alloy; Number of Rows: 4; Termination: SMD/SMT; Packaging: Tape and Reel; Gender: Male; Radiation Hardening: No; REACH SVHC: No SVHC; ComponentLink1URL: https://datasheet.ciiva.com/403/asp-134604-01-403751.pdf; ComponentLink1Description: https://datasheet.ciiva.com/403/asp-134604-01-403751.pdf; ComponentLink2URL: https://datasheet.ciiva.com/9532/asp-134604-01-9532665.pdf; ComponentLink2Description: https://datasheet.ciiva.com/9532/asp-134604-01-9532665.pdf; Supplier Part Number 1: SAM8732-ND; Manufacturer Part Number: ASP-134604-01

## Sheet Level_Shifters.SchDoc: Audio Research: Level Shifters
size A4; DrawnBy: Connor Dack; Engineer: Connor Dack; DocumentNumber: 6; Revision: 1.0; SheetNumber: 6; SheetTotal: 20
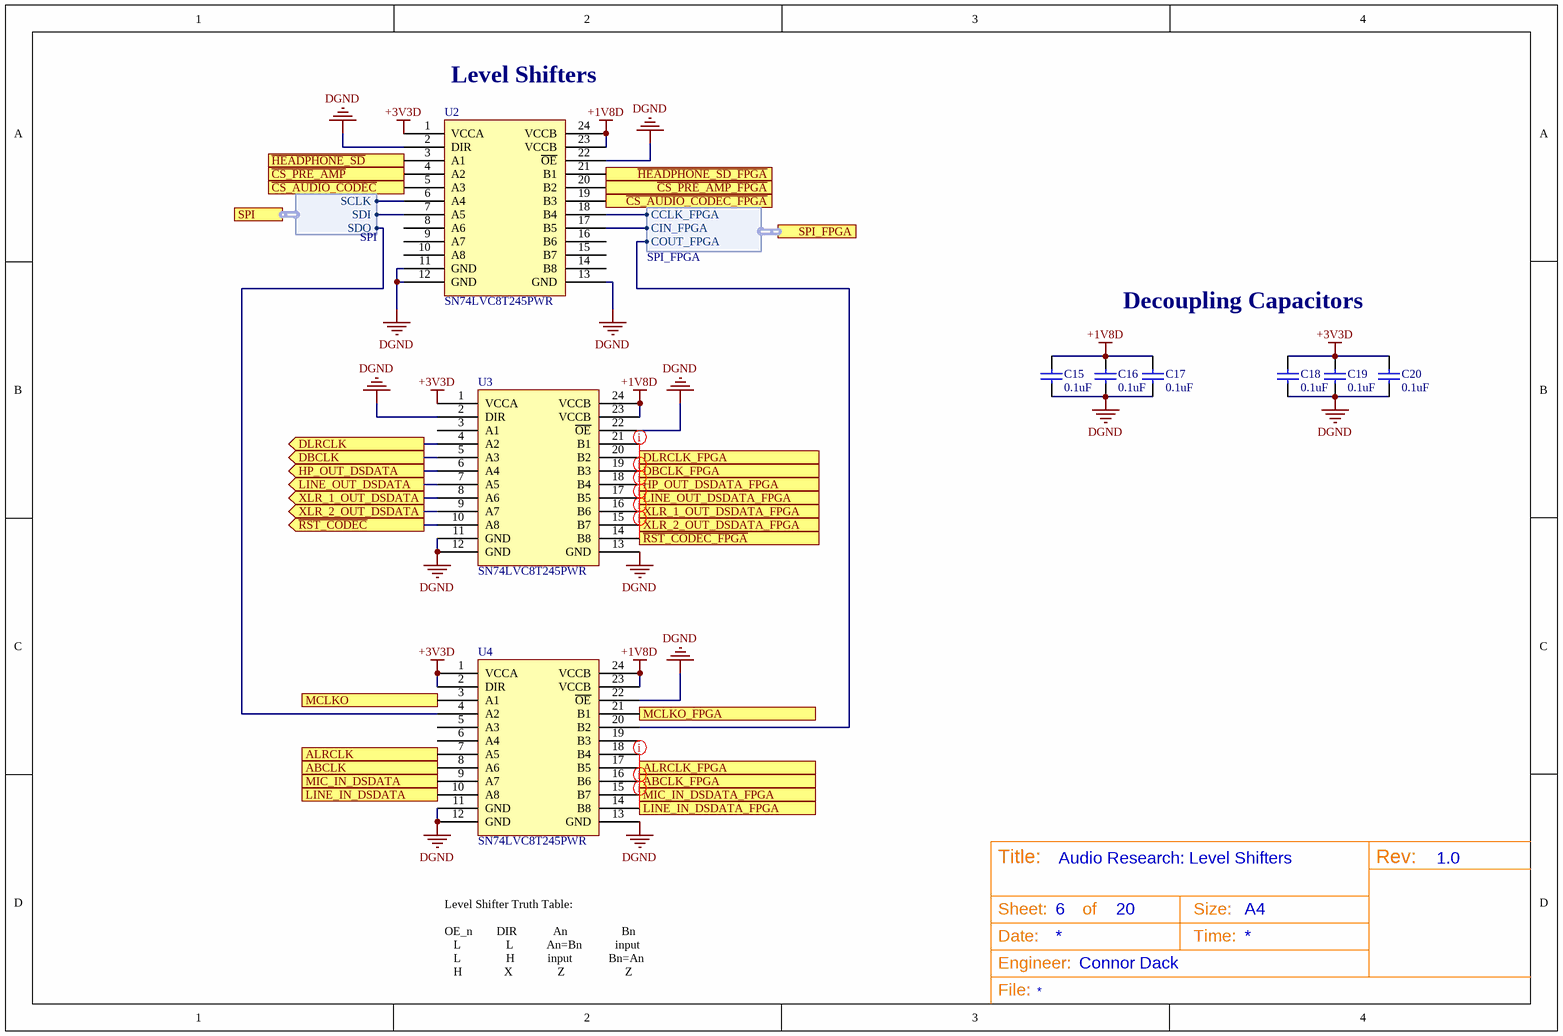
[diagram p18: Level_Shifters.SchDoc]

### Parts
C15  Capacitance: 0.1uF  [3-0603_L]  (hidden comment: CL10F104ZO8NNNC)
C16  Capacitance: 0.1uF  [3-0603_L]  (hidden comment: CL10F104ZO8NNNC)
C17  Capacitance: 0.1uF  [3-0603_L]  (hidden comment: CL10F104ZO8NNNC)
C18  Capacitance: 0.1uF  [3-0603_L]  (hidden comment: CL10F104ZO8NNNC)
C19  Capacitance: 0.1uF  [3-0603_L]  (hidden comment: CL10F104ZO8NNNC)
C20  Capacitance: 0.1uF  [3-0603_L]  (hidden comment: CL10F104ZO8NNNC)
U2  IC BUS TRANSCVR 8BIT 24TSSOP  [TSOP65P640X120-24N]  (value not drawn)
U3  IC BUS TRANSCVR 8BIT 24TSSOP  [TSOP65P640X120-24N]  (value not drawn)
U4  IC BUS TRANSCVR 8BIT 24TSSOP  [TSOP65P640X120-24N]  (value not drawn)

### Ports
ABCLK (in), ABCLK_FPGA (out), ALRCLK (in), ALRCLK_FPGA (out), DBCLK (out), DBCLK_FPGA (in), DLRCLK (out), DLRCLK_FPGA (in), HP_OUT_DSDATA (out), HP_OUT_DSDATA_FPGA (in), LINE_IN_DSDATA (in), LINE_IN_DSDATA_FPGA (out), LINE_OUT_DSDATA (out), LINE_OUT_DSDATA_FPGA (in), MCLKO (in), MCLKO_FPGA (out), MIC_IN_DSDATA (in), MIC_IN_DSDATA_FPGA (out), SPI (harness SPI), SPI_FPGA (harness SPI_FPGA), XLR_1_OUT_DSDATA (out), XLR_1_OUT_DSDATA_FPGA (in), XLR_2_OUT_DSDATA (out), XLR_2_OUT_DSDATA_FPGA (in), ~{CS_AUDIO_CODEC_FPGA} (in), ~{CS_AUDIO_CODEC} (out), ~{CS_PRE_AMP_FPGA} (in), ~{CS_PRE_AMP} (out), ~{HEADPHONE_SD_FPGA} (in), ~{HEADPHONE_SD} (out), ~{RST_CODEC_FPGA} (in), ~{RST_CODEC} (out)

### Harnesses
SPI_FPGA: CIN_FPGA, COUT_FPGA, CCLK_FPGA
SPI: SDI, SCLK, SDO

### Nets
+1V8D: C15.1 C16.1 C17.1 U2.23(VCCB) U2.24(VCCB) U3.23(VCCB) U3.24(VCCB) U4.23(VCCB) U4.24(VCCB)
+3V3D: C18.1 C19.1 C20.1 U2.1(VCCA) U3.1(VCCA) U4.1(VCCA) U4.2(DIR)
DGND: C15.2 C16.2 C17.2 C18.2 C19.2 C20.2 U2.2(DIR) U2.11(GND) U2.12(GND) U2.13(GND) U2.22(~{OE}) U3.2(DIR) U3.11(GND) U3.12(GND) U3.13(GND) U3.22(~{OE}) U4.11(GND) U4.12(GND) U4.13(GND) U4.22(~{OE})  [project net AGND]
~{RST_CODEC}: U3.10(A8) ; port ~{RST_CODEC}
~{RST_CODEC_FPGA}: U3.14(B8) ; port ~{RST_CODEC_FPGA}
ABCLK: U4.8(A6) ; port ABCLK
ABCLK_FPGA: U4.16(B6) ; port ABCLK_FPGA
ALRCLK: U4.7(A5) ; port ALRCLK
ALRCLK_FPGA: U4.17(B5) ; port ALRCLK_FPGA
~{CS_AUDIO_CODEC}: U2.5(A3) ; port ~{CS_AUDIO_CODEC}
~{CS_AUDIO_CODEC_FPGA}: U2.19(B3) ; port ~{CS_AUDIO_CODEC_FPGA}
~{CS_PRE_AMP}: U2.4(A2) ; port ~{CS_PRE_AMP}
~{CS_PRE_AMP_FPGA}: U2.20(B2) ; port ~{CS_PRE_AMP_FPGA}
COUT: U4.20(B2) ; port SPI_FPGA.COUT_FPGA
DBCLK: U3.5(A3) ; port DBCLK
DBCLK_FPGA: U3.19(B3) ; port DBCLK_FPGA
DLRCLK: U3.4(A2) ; port DLRCLK
DLRCLK_FPGA: U3.20(B2) ; port DLRCLK_FPGA
~{HEADPHONE_SD}: U2.3(A1) ; port ~{HEADPHONE_SD}
~{HEADPHONE_SD_FPGA}: U2.21(B1) ; port ~{HEADPHONE_SD_FPGA}
HP_OUT_DSDATA: U3.6(A4) ; port HP_OUT_DSDATA
HP_OUT_DSDATA_FPGA: U3.18(B4) ; port HP_OUT_DSDATA_FPGA
LINE_IN_DSDATA: U4.10(A8) ; port LINE_IN_DSDATA
LINE_IN_DSDATA_FPGA: U4.14(B8) ; port LINE_IN_DSDATA_FPGA
LINE_OUT_DSDATA: U3.7(A5) ; port LINE_OUT_DSDATA
LINE_OUT_DSDATA_FPGA: U3.17(B5) ; port LINE_OUT_DSDATA_FPGA
MCLKO: U4.3(A1) ; port MCLKO
MCLKO_FPGA: U4.21(B1) ; port MCLKO_FPGA
MIC_IN_DSDATA: U4.9(A7) ; port MIC_IN_DSDATA
MIC_IN_DSDATA_FPGA: U4.15(B7) ; port MIC_IN_DSDATA_FPGA
SCLK: U2.6(A4) ; port SPI.SCLK
SDI: U2.7(A5) ; port SPI.SDI
SDO: U4.4(A2) ; port SPI.SDO
XLR_1_OUT_DSDATA: U3.8(A6) ; port XLR_1_OUT_DSDATA
XLR_1_OUT_DSDATA_FPGA: U3.16(B6) ; port XLR_1_OUT_DSDATA_FPGA
XLR_2_OUT_DSDATA: U3.9(A7) ; port XLR_2_OUT_DSDATA
XLR_2_OUT_DSDATA_FPGA: U3.15(B7) ; port XLR_2_OUT_DSDATA_FPGA
NetJ1_G28: U2.17(B5) ; port SPI_FPGA.CIN_FPGA
NetJ1_G31: U2.18(B4) ; port SPI_FPGA.CCLK_FPGA

Not connected (* = marked no-connect by the designer): U2 8(A6) 9(A7) 10(A8) 14(B8) 15(B7) 16(B6); U3 3(A1) 21(B1); U4 5(A3) 6(A4) 18(B4) 19(B3)

### Layout directives
net class 1V8_Audio_In: ALRCLK_FPGA, LINE_IN_DSDATA_FPGA, MIC_IN_DSDATA_FPGA
net class 1V8_Audio_Out: DLRCLK_FPGA, HP_OUT_DSDATA_FPGA, LINE_OUT_DSDATA_FPGA, XLR_1_OUT_DSDATA_FPGA, XLR_2_OUT_DSDATA_FPGA, ~{RST_CODEC_FPGA}

### Notes on the sheet
- (near U2) Level Shifters
- Decoupling Capacitors
- Level Shifter Truth Table:
  OE_n        DIR            An                  Bn
  L               L           An=Bn           input
  L               H           input            Bn=An
  H              X               Z                    Z
- Title:
- Sheet:
- of
- Size:
- A4
- Rev:
- Date:
- Engineer:
- Time:
- File:

### Library data of the parts
C15-C20 = CL10F104ZO8NNNC: as C69 on sheet Audio_Input_Mic_In; Supplier 1: Digi-Key; Stock 1: 40000; Pricing 1: 1=0.1, 10=0.038, 100=0.0169, 500=0.01208, 1000=0.00949 (USD); Mount: Surface Mount; Case/Package: 0603; Case Code (Metric): 1608; Case Code (Imperial): 0603; Min Operating Temperature: -30°C; Max Operating Temperature: 85°C; Package Quantity: 1; Packaging: Tape and Reel; Voltage Rating: 16V; Dielectric: Y5V; Length: 1.6mm; Height: 0.8mm; Width: 0.031inch; Thickness: 0.035inch; Depth: 0.8mm; Radiation Hardening: No; ComponentLink1URL: https://datasheet.ciiva.com/25805/cl10f104zo8nnnc-25805810.pdf; ComponentLink1Description: https://datasheet.ciiva.com/25805/cl10f104zo8nnnc-25805810.pdf; ComponentLink2URL: https://datasheet.ciiva.com/16199/cl10f104zo8nnnc-16199254.pdf; ComponentLink2Description: https://datasheet.ciiva.com/16199/cl10f104zo8nnnc-16199254.pdf; Supplier Part Number 1: 1276-1258-6-ND; Manufacturer Part Number: CL10F104ZO8NNNC
U2-U4 = SN74LVC8T245PWR: Voltage Level Translator Bidirectional 1 Circuit 8 Channel 24-TSSOP; Manufacturer: Texas Instruments; Number of Channels: 8; Propagation Delay: 4.2ns; Number of Elements: 1; Min Supply Voltage: 1.65V; Max Supply Voltage: 5.5V; Operating Supply Voltage: 3.3V; Data Rate: 500Mbps; Logic Function: Transceiver,Translator; High Level Output Current: -32mA; Low Level Output Current: 32mA; Polarity: Non-Inverting; Turn-On Delay Time: 32.2ns; Quiescent Current: 15uA; ComponentLink1URL: https://datasheet.ciiva.com/1899/sn74lvc8t245-1899395.pdf; ComponentLink1Description: https://datasheet.ciiva.com/1899/sn74lvc8t245-1899395.pdf; ComponentLink2URL: https://datasheet.ciiva.com/34301/1048559-34301923.pdf; ComponentLink2Description: https://datasheet.ciiva.com/34301/1048559-34301923.pdf; ComponentLink3URL: https://datasheet.ciiva.com/1899/sn74lvc8t245-1899396.pdf; ComponentLink3Description: https://datasheet.ciiva.com/1899/sn74lvc8t245-1899396.pdf; ComponentLink4URL: https://datasheet.ciiva.com/1899/sn74lvc8t245-1899397.pdf; ComponentLink4Description: https://datasheet.ciiva.com/1899/sn74lvc8t245-1899397.pdf; ComponentLink5URL: https://datasheet.ciiva.com/7795/1763937-7795013.pdf; ComponentLink5Description: https://datasheet.ciiva.com/7795/1763937-7795013.pdf; ComponentLink6URL: https://datasheet.ciiva.com/15086/getdatasheetpartid-48801-15086005.pdf; ComponentLink6Description: https://datasheet.ciiva.com/15086/getdatasheetpartid-48801-15086005.pdf; ComponentLink7URL: https://datasheet.ciiva.com/25973/sn74lvc8t245-25973803.pdf; ComponentLink7Description: https://datasheet.ciiva.com/25973/sn74lvc8t245-25973803.pdf; ComponentLink8URL: https://datasheet.ciiva.com/46439/1831204-46439647.pdf; ComponentLink8Description: https://datasheet.ciiva.com/46439/1831204-46439647.pdf; ComponentLink9URL: https://datasheet.ciiva.com/26867/sn74lvc8t245pwr-26867745.pdf; ComponentLink9Description: https://datasheet.ciiva.com/26867/sn74lvc8t245pwr-26867745.pdf; ComponentLink10URL: https://datasheet.ciiva.com/41455/001017232-da-01-en-ic-bus-8bit-sn74lvc8t245pwr-tssop-24-tid-41455868.pdf; ComponentLink10Description: https://datasheet.ciiva.com/41455/001017232-da-01-en-ic-bus-8bit-sn74lvc8t245pwr-tssop-24-tid-41455868.pdf; Supplier 1: Digi-Key; Stock 1: 119243; Pricing 1: 1=1.05, 10=0.936, 100=0.7297, 500=0.6028, 1000=0.4759 (USD); Mount: Surface Mount; Case/Package: TSSOP; Number of Pins: 24; Weight: 0.003157oz; Contact Plating: Gold; Min Operating Temperature: -40°C; Max Operating Temperature: 85°C; Package Quantity: 1; Packaging: Tape and Reel; Direction: Bidirectional; Number of Bits: 8; Number of Outputs: 8; Length: 7.9mm; Height: 1.05mm; Width: 4.5mm; Radiation Hardening: No; REACH SVHC: No SVHC; Lead Free: Lead Free; Supplier Part Number 1: 296-18593-6-ND; Manufacturer Part Number: SN74LVC8T245PWR